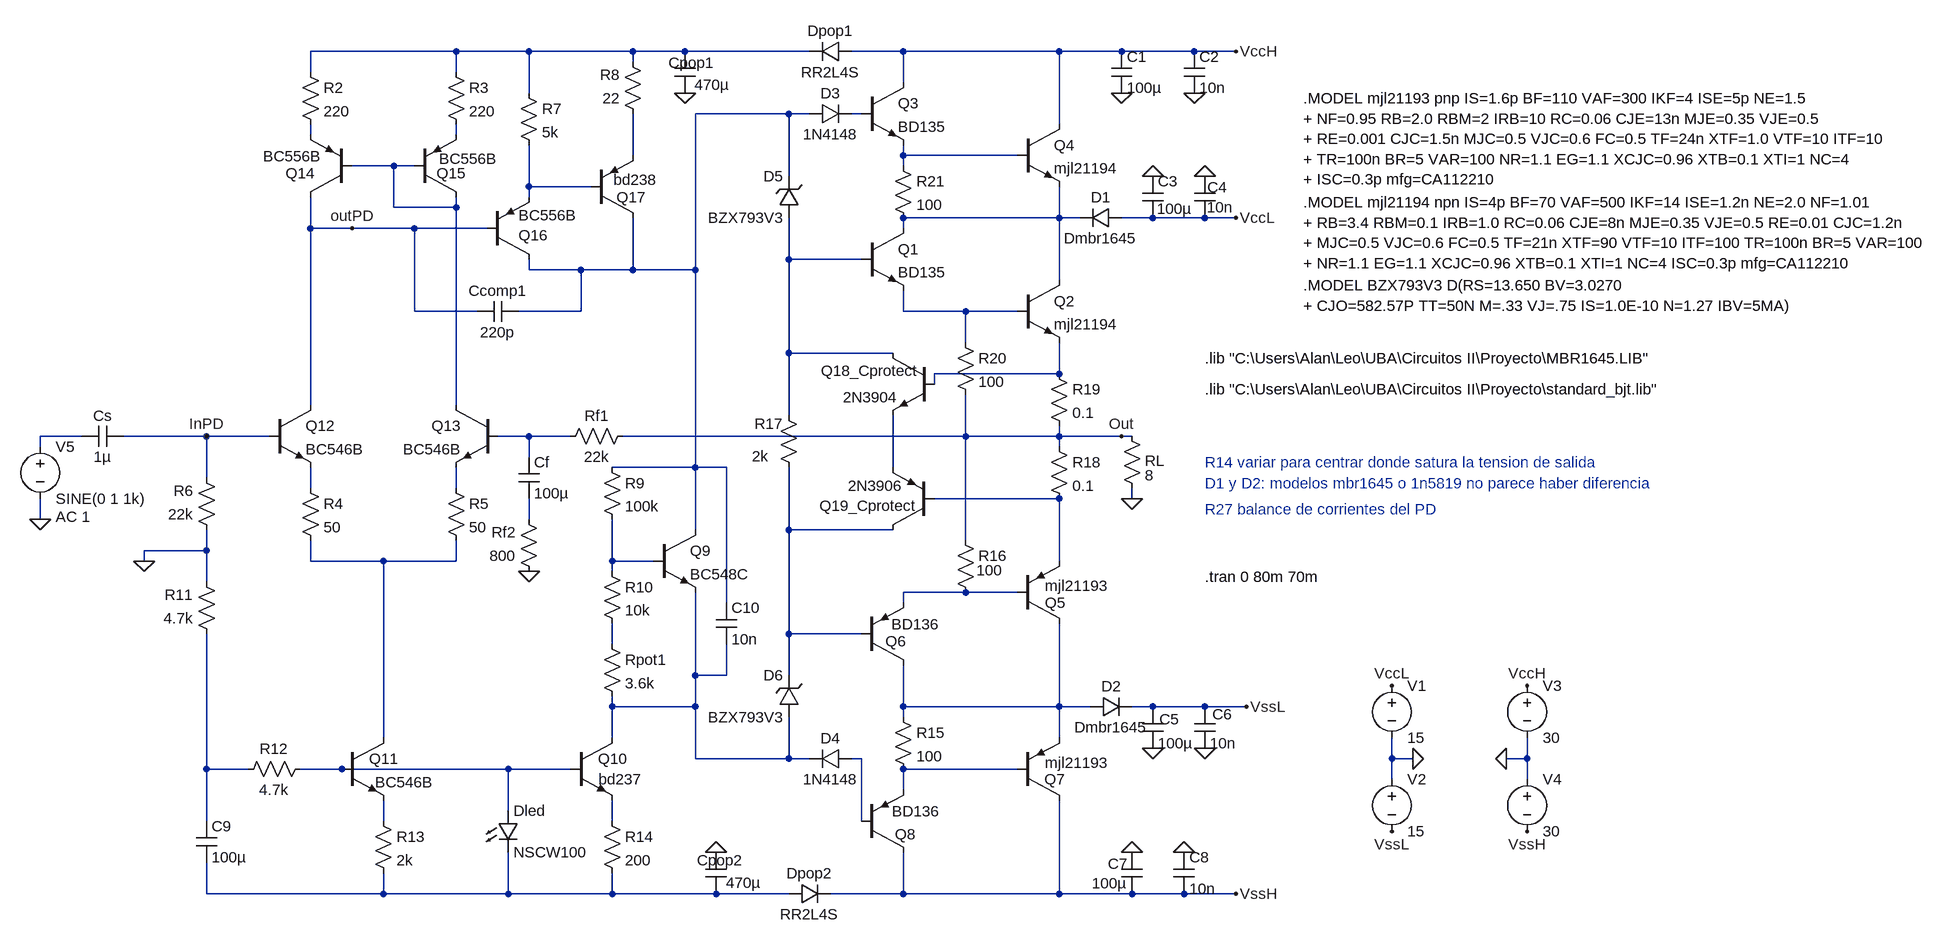
[diagram p0: schematic etapa_ampli_2Darli.asc]
etapa_ampli_2Darli.asc, the LTspice schematic file:
Version 4
SHEET 1 2408 1408
WIRE -512 48 -736 48
WIRE -400 48 -512 48
WIRE -240 48 -400 48
WIRE -160 48 -240 48
WIRE 32 48 -160 48
WIRE 176 48 96 48
WIRE 416 48 176 48
WIRE 512 48 416 48
WIRE 624 48 512 48
WIRE 688 48 624 48
WIRE -240 64 -240 48
WIRE -736 80 -736 48
WIRE -512 80 -512 48
WIRE 176 96 176 48
WIRE -400 112 -400 48
WIRE 0 144 -144 144
WIRE 32 144 0 144
WIRE 112 144 96 144
WIRE 416 160 416 48
WIRE -736 176 -736 160
WIRE -512 176 -512 160
WIRE -240 208 -240 144
WIRE 176 208 176 192
WIRE 352 208 176 208
WIRE -608 224 -672 224
WIRE -576 224 -608 224
WIRE 176 224 176 208
WIRE 0 240 0 144
WIRE -400 256 -400 192
WIRE -304 256 -400 256
WIRE -400 272 -400 256
WIRE -608 288 -608 224
WIRE -512 288 -512 272
WIRE -512 288 -608 288
WIRE 416 304 416 256
WIRE 416 304 176 304
WIRE 448 304 416 304
WIRE 560 304 512 304
WIRE 640 304 560 304
WIRE 688 304 640 304
WIRE -736 320 -736 272
WIRE -672 320 -736 320
WIRE -576 320 -672 320
WIRE -464 320 -576 320
WIRE 176 320 176 304
WIRE 0 368 0 304
WIRE 112 368 0 368
WIRE -400 384 -400 368
WIRE -320 384 -400 384
WIRE -240 384 -240 304
WIRE -240 384 -320 384
WIRE -144 384 -144 144
WIRE -144 384 -240 384
WIRE 416 400 416 304
WIRE -576 448 -576 320
WIRE -480 448 -576 448
WIRE -320 448 -320 384
WIRE -320 448 -416 448
WIRE 176 448 176 416
WIRE 272 448 176 448
WIRE 352 448 272 448
WIRE 272 496 272 448
WIRE 0 512 0 368
WIRE 160 512 0 512
WIRE 416 544 416 496
WIRE 416 544 224 544
WIRE 224 560 224 544
WIRE -736 592 -736 320
WIRE -512 592 -512 288
WIRE 0 608 0 512
WIRE -1088 640 -1152 640
WIRE -896 640 -1024 640
WIRE -800 640 -896 640
WIRE -400 640 -448 640
WIRE -336 640 -400 640
WIRE 272 640 272 576
WIRE 272 640 -256 640
WIRE 416 640 416 624
WIRE 416 640 272 640
WIRE 512 640 416 640
WIRE 528 640 512 640
WIRE -1152 656 -1152 640
WIRE 416 656 416 640
WIRE -400 672 -400 640
WIRE -144 688 -144 384
WIRE -144 688 -272 688
WIRE -96 688 -144 688
WIRE 160 688 160 608
WIRE -896 704 -896 640
WIRE -736 720 -736 688
WIRE -512 720 -512 688
WIRE 416 736 224 736
WIRE 528 736 528 720
WIRE -1152 768 -1152 736
WIRE -400 768 -400 736
WIRE -144 784 -144 688
WIRE 0 784 0 688
WIRE 160 784 0 784
WIRE 272 800 272 640
WIRE -896 816 -896 784
WIRE -896 816 -992 816
WIRE -992 832 -992 816
WIRE -736 832 -736 800
WIRE -624 832 -736 832
WIRE -512 832 -512 800
WIRE -512 832 -624 832
WIRE -272 832 -272 768
WIRE -208 832 -272 832
WIRE 416 832 416 736
WIRE -272 848 -272 832
WIRE -896 864 -896 816
WIRE 272 880 176 880
WIRE 352 880 272 880
WIRE -96 896 -96 688
WIRE 176 896 176 880
WIRE 0 944 0 784
WIRE 112 944 0 944
WIRE -272 960 -272 928
WIRE -144 1008 -144 880
WIRE -96 1008 -96 960
WIRE -96 1008 -144 1008
WIRE 0 1008 0 944
WIRE -272 1056 -272 1040
WIRE -144 1056 -144 1008
WIRE -144 1056 -272 1056
WIRE 176 1056 176 992
WIRE 416 1056 416 928
WIRE 416 1056 176 1056
WIRE 464 1056 416 1056
WIRE 560 1056 528 1056
WIRE 640 1056 560 1056
WIRE 704 1056 640 1056
WIRE 176 1072 176 1056
WIRE -624 1104 -624 832
WIRE -272 1104 -272 1056
WIRE 416 1104 416 1056
WIRE -144 1136 -144 1056
WIRE 0 1136 0 1072
WIRE 0 1136 -144 1136
WIRE 32 1136 0 1136
WIRE 112 1136 96 1136
WIRE 928 1136 928 1104
WIRE 960 1136 928 1136
WIRE 1136 1136 1136 1104
WIRE 1136 1136 1104 1136
WIRE -896 1152 -896 944
WIRE -832 1152 -896 1152
WIRE -688 1152 -752 1152
WIRE -432 1152 -688 1152
WIRE -336 1152 -432 1152
WIRE 352 1152 176 1152
WIRE 928 1168 928 1136
WIRE 1136 1168 1136 1136
WIRE 176 1184 176 1152
WIRE -432 1216 -432 1152
WIRE -896 1232 -896 1152
WIRE -624 1232 -624 1200
WIRE -272 1232 -272 1200
WIRE 112 1232 112 1136
WIRE -896 1344 -896 1296
WIRE -624 1344 -624 1312
WIRE -624 1344 -896 1344
WIRE -432 1344 -432 1280
WIRE -432 1344 -624 1344
WIRE -272 1344 -272 1312
WIRE -272 1344 -432 1344
WIRE -112 1344 -272 1344
WIRE 0 1344 -112 1344
WIRE 176 1344 176 1280
WIRE 176 1344 64 1344
WIRE 416 1344 416 1200
WIRE 416 1344 176 1344
WIRE 528 1344 416 1344
WIRE 608 1344 528 1344
WIRE 688 1344 608 1344
FLAG 688 304 VccL
FLAG 688 48 VccH
FLAG 528 736 0
FLAG 688 1344 VssH
FLAG 960 1136 0
FLAG 1104 1136 0
FLAG 1136 1024 VccH
FLAG 928 1024 VccL
FLAG 1136 1248 VssH
FLAG 928 1248 VssL
FLAG 512 640 Out
FLAG -400 848 0
FLAG -992 832 0
FLAG 704 1056 VssL
FLAG -896 640 InPD
FLAG -160 112 0
FLAG -112 1280 0
FLAG 560 1120 0
FLAG 528 1280 0
FLAG 560 240 0
FLAG 512 112 0
FLAG 624 112 0
FLAG 608 1280 0
FLAG 640 240 0
FLAG 640 1120 0
FLAG -672 320 outPD
FLAG -1152 768 0
DATAFLAG 48 368 "$-V(N013)"
DATAFLAG 48 944 "$-V(N019)"
DATAFLAG 416 112 "$-V(N010)"
DATAFLAG 416 1248 "$-V(N027)"
SYMBOL res 512 624 R0
WINDOW 0 36 54 Left 2
SYMATTR InstName RL
SYMATTR Value 8
SYMBOL voltage 928 1008 R0
WINDOW 123 0 0 Left 0
WINDOW 39 0 0 Left 0
SYMATTR InstName V1
SYMATTR Value 15
SYMBOL voltage 928 1152 R0
WINDOW 123 0 0 Left 0
WINDOW 39 0 0 Left 0
SYMATTR InstName V2
SYMATTR Value 15
SYMBOL voltage 1136 1008 R0
WINDOW 123 0 0 Left 0
WINDOW 39 0 0 Left 0
SYMATTR InstName V3
SYMATTR Value 30
SYMBOL voltage 1136 1152 R0
WINDOW 123 0 0 Left 0
WINDOW 39 0 0 Left 0
SYMATTR InstName V4
SYMATTR Value 30
SYMBOL diode 32 160 R270
WINDOW 0 32 32 VTop 2
WINDOW 3 0 32 VBottom 2
SYMATTR InstName D3
SYMATTR Value 1N4148
SYMBOL diode 96 1120 R90
WINDOW 0 0 32 VBottom 2
WINDOW 3 32 32 VTop 2
SYMATTR InstName D4
SYMATTR Value 1N4148
SYMBOL npn -208 784 R0
SYMATTR InstName Q9
SYMATTR Value BC548C
SYMBOL res -288 672 R0
SYMATTR InstName R9
SYMATTR Value 100k
SYMBOL res -288 832 R0
SYMATTR InstName R10
SYMATTR Value 10k
SYMBOL npn -336 1104 R0
WINDOW 0 42 32 Left 2
WINDOW 3 43 64 Left 2
SYMATTR InstName Q10
SYMATTR Value bd237
SYMBOL res -288 1216 R0
SYMATTR InstName R14
SYMATTR Value 200
SYMBOL npn -448 592 M0
SYMATTR InstName Q13
SYMATTR Value BC546B
SYMBOL res -240 624 R90
WINDOW 0 0 56 VBottom 2
WINDOW 3 32 56 VTop 2
SYMATTR InstName Rf1
SYMATTR Value 22k
SYMBOL res -384 864 R180
WINDOW 0 36 76 Left 2
WINDOW 3 36 40 Left 2
SYMATTR InstName Rf2
SYMATTR Value 800
SYMBOL cap -416 672 R0
SYMATTR InstName Cf
SYMATTR Value 100µ
SYMBOL res -16 592 R0
WINDOW 0 -37 29 Left 2
WINDOW 3 -41 79 Left 2
SYMATTR InstName R17
SYMATTR Value 2k
SYMBOL npn -800 592 R0
SYMATTR InstName Q12
SYMATTR Value BC546B
SYMBOL npn -688 1104 R0
WINDOW 0 42 32 Left 2
WINDOW 3 51 68 Left 2
SYMATTR InstName Q11
SYMATTR Value BC546B
SYMBOL res -640 1216 R0
SYMATTR InstName R13
SYMATTR Value 2k
SYMBOL res -736 1136 R90
WINDOW 0 0 56 VBottom 2
WINDOW 3 32 56 VTop 2
SYMATTR InstName R12
SYMATTR Value 4.7k
SYMBOL res -880 800 R180
WINDOW 0 36 76 Left 2
WINDOW 3 36 40 Left 2
SYMATTR InstName R6
SYMATTR Value 22k
SYMBOL res -880 960 R180
WINDOW 0 36 76 Left 2
WINDOW 3 36 40 Left 2
SYMATTR InstName R11
SYMATTR Value 4.7k
SYMBOL cap -912 1232 R0
SYMATTR InstName C9
SYMATTR Value 100µ
SYMBOL cap -1024 624 R90
WINDOW 0 0 32 VBottom 2
WINDOW 3 32 32 VTop 2
SYMATTR InstName Cs
SYMATTR Value 1µ
SYMBOL pnp -672 272 R180
WINDOW 0 57 37 Left 2
WINDOW 3 48 63 Left 2
SYMATTR InstName Q14
SYMATTR Value BC556B
SYMBOL pnp -576 272 M180
WINDOW 0 34 37 Left 2
WINDOW 3 38 59 Left 2
SYMATTR InstName Q15
SYMATTR Value BC556B
SYMBOL res -416 96 R0
SYMATTR InstName R7
SYMATTR Value 5k
SYMBOL pnp -464 368 M180
WINDOW 0 48 37 Left 2
WINDOW 3 48 68 Left 2
SYMATTR InstName Q16
SYMATTR Value BC556B
SYMBOL zener 16 1072 R180
WINDOW 0 24 64 Left 2
WINDOW 3 24 0 Left 2
SYMATTR InstName D6
SYMATTR Value BZX793V3
SYMBOL zener 16 304 R180
WINDOW 0 24 64 Left 2
WINDOW 3 24 0 Left 2
SYMATTR InstName D5
SYMATTR Value BZX793V3
SYMBOL LED -448 1216 R0
SYMATTR InstName Dled
SYMATTR Value NSCW100
SYMBOL res -224 160 R180
WINDOW 0 36 76 Left 2
WINDOW 3 36 40 Left 2
SYMATTR InstName R8
SYMATTR Value 22
SYMBOL pnp -304 304 M180
WINDOW 0 39 32 Left 2
WINDOW 3 34 59 Left 2
SYMATTR InstName Q17
SYMATTR Value bd238
SYMBOL cap -416 432 R90
WINDOW 0 0 32 VBottom 2
WINDOW 3 32 32 VTop 2
SYMATTR InstName Ccomp1
SYMATTR Value 220p
SYMBOL diode 0 1360 R270
WINDOW 0 32 32 VTop 2
WINDOW 3 0 32 VBottom 2
SYMATTR InstName Dpop2
SYMATTR Value RR2L4S
SYMBOL diode 96 32 R90
WINDOW 0 0 32 VBottom 2
WINDOW 3 32 32 VTop 2
SYMATTR InstName Dpop1
SYMATTR Value RR2L4S
SYMBOL cap -144 112 R180
WINDOW 0 -30 47 Left 2
WINDOW 3 -53 13 Left 2
SYMATTR InstName Cpop1
SYMATTR Value 470µ
SYMBOL cap -96 1344 R180
WINDOW 0 -26 52 Left 2
WINDOW 3 -53 17 Left 2
SYMATTR InstName Cpop2
SYMATTR Value 470µ
SYMBOL cap 512 1280 R0
WINDOW 0 -21 18 Left 2
WINDOW 3 -46 48 Left 2
SYMATTR InstName C7
SYMATTR Value 100µ
SYMBOL cap 496 48 R0
SYMATTR InstName C1
SYMATTR Value 100µ
SYMBOL cap 544 240 R0
WINDOW 3 22 50 Left 2
SYMATTR Value 100µ
SYMATTR InstName C3
SYMBOL cap 544 1056 R0
WINDOW 0 26 19 Left 2
SYMATTR InstName C5
SYMATTR Value 100µ
SYMBOL res -752 64 R0
SYMATTR InstName R2
SYMATTR Value 220
SYMBOL res -528 64 R0
SYMATTR InstName R3
SYMATTR Value 220
SYMBOL cap 608 48 R0
SYMATTR InstName C2
SYMATTR Value 10n
SYMBOL cap 592 1280 R0
SYMATTR InstName C8
SYMATTR Value 10n
SYMBOL cap 624 240 R0
WINDOW 0 20 17 Left 2
WINDOW 3 19 48 Left 2
SYMATTR InstName C4
SYMATTR Value 10n
SYMBOL cap 624 1056 R0
WINDOW 0 28 12 Left 2
SYMATTR InstName C6
SYMATTR Value 10n
SYMBOL diode 464 1072 R270
WINDOW 0 32 32 VTop 2
WINDOW 3 0 32 VBottom 2
SYMATTR InstName D2
SYMATTR Value Dmbr1645
SYMBOL diode 512 288 R90
WINDOW 0 0 32 VBottom 2
WINDOW 3 32 32 VTop 2
SYMATTR InstName D1
SYMATTR Value Dmbr1645
SYMBOL npn 224 512 M0
WINDOW 0 24 27 Left 2
SYMATTR InstName Q18_Cprotect
SYMATTR Value 2N3904
SYMBOL pnp 224 784 R180
WINDOW 0 26 37 Left 2
WINDOW 3 48 68 Left 2
SYMATTR InstName Q19_Cprotect
SYMATTR Value 2N3906
SYMBOL res -752 704 R0
SYMATTR InstName R4
SYMATTR Value 50
SYMBOL res -528 704 R0
SYMATTR InstName R5
SYMATTR Value 50
SYMBOL voltage -1152 640 R0
WINDOW 123 24 124 Left 2
WINDOW 39 0 0 Left 0
SYMATTR Value2 AC 1
SYMATTR InstName V5
SYMATTR Value SINE(0 1 1k)
SYMBOL res 400 640 R0
SYMATTR InstName R18
SYMATTR Value 0.1
SYMBOL res 400 528 R0
SYMATTR InstName R19
SYMATTR Value 0.1
SYMBOL npn 112 320 R0
SYMATTR InstName Q1
SYMATTR Value BD135
SYMBOL npn 352 400 R0
SYMATTR InstName Q2
SYMATTR Value mjl21194
SYMBOL npn 112 96 R0
SYMATTR InstName Q3
SYMATTR Value BD135
SYMBOL npn 352 160 R0
SYMATTR InstName Q4
SYMATTR Value mjl21194
SYMBOL pnp 352 928 M180
WINDOW 0 42 32 Left 2
WINDOW 3 42 58 Left 2
SYMATTR InstName Q5
SYMATTR Value mjl21193
SYMBOL pnp 112 992 M180
WINDOW 0 37 37 Left 2
WINDOW 3 46 63 Left 2
SYMATTR InstName Q6
SYMATTR Value BD136
SYMBOL pnp 352 1200 M180
WINDOW 0 41 32 Left 2
WINDOW 3 42 58 Left 2
SYMATTR InstName Q7
SYMATTR Value mjl21193
SYMBOL pnp 112 1280 M180
WINDOW 0 51 28 Left 2
WINDOW 3 47 63 Left 2
SYMATTR InstName Q8
SYMATTR Value BD136
SYMBOL res 160 1056 R0
SYMATTR InstName R15
SYMATTR Value 100
SYMBOL res 256 784 R0
WINDOW 3 73 62 Right 2
SYMATTR Value 100
SYMATTR InstName R16
SYMBOL res 256 480 R0
SYMATTR InstName R20
SYMATTR Value 100
SYMBOL res 160 208 R0
SYMATTR InstName R21
SYMATTR Value 100
SYMBOL res -288 944 R0
SYMATTR InstName Rpot1
SYMATTR Value 3.6k
SYMBOL cap -112 896 R0
SYMATTR InstName C10
SYMATTR Value 10n
TEXT 640 568 Left 2 !.lib "C:\\Users\\Alan\\Leo\\UBA\\Circuitos II\\Proyecto\\standard_bjt.lib"
TEXT 640 856 Left 2 !.tran 0 80m 70m
TEXT 640 520 Left 2 !.lib "C:\\Users\\Alan\\Leo\\UBA\\Circuitos II\\Proyecto\\MBR1645.LIB"
TEXT 640 712 Left 2 ;D1 y D2: modelos mbr1645 o 1n5819 no parece haber diferencia
TEXT 640 752 Left 2 ;R27 balance de corrientes del PD
TEXT 640 680 Left 2 ;R14 variar para centrar donde satura la tension de salida
TEXT 792 408 Left 2 !.MODEL BZX793V3 D(RS=13.650 BV=3.0270  \n+ CJO=582.57P TT=50N M=.33 VJ=.75 IS=1.0E-10 N=1.27 IBV=5MA)
TEXT 792 120 Left 2 !.MODEL mjl21193 pnp IS=1.6p BF=110 VAF=300 IKF=4 ISE=5p NE=1.5\n+ NF=0.95 RB=2.0 RBM=2 IRB=10 RC=0.06 CJE=13n MJE=0.35 VJE=0.5\n+ RE=0.001 CJC=1.5n MJC=0.5 VJC=0.6 FC=0.5 TF=24n XTF=1.0 VTF=10 ITF=10\n+ TR=100n BR=5 VAR=100 NR=1.1 EG=1.1 XCJC=0.96 XTB=0.1 XTI=1 NC=4\n+ ISC=0.3p mfg=CA112210
TEXT 792 280 Left 2 !.MODEL mjl21194 npn IS=4p BF=70 VAF=500 IKF=14 ISE=1.2n NE=2.0 NF=1.01\n+ RB=3.4 RBM=0.1 IRB=1.0 RC=0.06 CJE=8n MJE=0.35 VJE=0.5 RE=0.01 CJC=1.2n\n+ MJC=0.5 VJC=0.6 FC=0.5 TF=21n XTF=90 VTF=10 ITF=100 TR=100n BR=5 VAR=100\n+ NR=1.1 EG=1.1 XCJC=0.96 XTB=0.1 XTI=1 NC=4 ISC=0.3p mfg=CA112210

The netlist it stands for:
* etapa_ampli_2Darli.asc
RL Out 0 8
V1 VccL 0 15
V2 0 VssL 15
V3 VccH 0 30
V4 0 VssH 30
D3 N002 N003 1N4148
D4 N028 N026 1N4148
Q9 N002 N023 N026 0 BC548C
R9 N002 N023 100k
R10 N023 N025 10k
Q10 N026 N030 N033 0 bd237
R14 N033 N034 200
Q13 N008 N015 N018 0 BC546B
Rf1 Out N015 22k
Rf2 0 N020 800
Cf N015 N020 100µ
R17 N011 N021 2k
Q12 outPD InPD N017 0 BC546B
Q11 N022 N030 N032 0 BC546B
R13 N032 N034 2k
R12 N030 N029 4.7k
R6 0 InPD 22k
R11 N029 0 4.7k
C9 N029 N034 100µ
Cs InPD N014 1µ
Q14 outPD N008 N004 0 BC556B
Q15 N008 N008 N005 0 BC556B
R7 N001 N009 5k
Q16 N002 outPD N009 0 BC556B
D6 N026 N021 BZX793V3
D5 N011 N002 BZX793V3
Dled N030 N034 NSCW100
R8 N006 N001 22
Q17 N002 N009 N006 0 bd238
Ccomp1 N002 outPD 220p
Dpop2 N034 VssH RR2L4S
Dpop1 VccH N001 RR2L4S
Cpop1 0 N001 470µ
Cpop2 N034 0 470µ
C7 0 VssH 100µ
C1 VccH 0 100µ
C3 0 VccL 100µ
C5 VssL 0 100µ
R2 N001 N004 220
R3 N001 N005 220
C2 VccH 0 10n
C8 0 VssH 10n
C4 0 VccL 10n
C6 VssL 0 10n
D2 N027 VssL Dmbr1645
D1 VccL N010 Dmbr1645
Q18_Cprotect N011 N013 N016 0 2N3904
Q19_Cprotect N021 N019 N016 0 2N3906
R4 N017 N022 50
R5 N018 N022 50
V5 N014 0 SINE(0 1 1k) AC 1
R18 Out N019 0.1
R19 N013 Out 0.1
Q1 N010 N011 N012 0 BD135
Q2 N010 N012 N013 0 mjl21194
Q3 VccH N003 N007 0 BD135
Q4 VccH N007 N010 0 mjl21194
Q5 N027 N024 N019 0 mjl21193
Q6 N027 N021 N024 0 BD136
Q7 VssH N031 N027 0 mjl21193
Q8 VssH N028 N031 0 BD136
R15 N027 N031 100
R16 Out N024 100
R20 N012 Out 100
R21 N007 N010 100
Rpot1 N025 N026 3.6k
C10 N002 N026 10n
.model D D
.lib standard.dio
.model NPN NPN
.model PNP PNP
.lib standard.bjt
.lib "C:\Users\Alan\Leo\UBA\Circuitos II\Proyecto\standard_bjt.lib"
.tran 0 80m 70m
.lib "C:\Users\Alan\Leo\UBA\Circuitos II\Proyecto\MBR1645.LIB"
* D1 y D2: modelos mbr1645 o 1n5819 no parece haber diferencia
* R27 balance de corrientes del PD
* R14 variar para centrar donde satura la tension de salida
.MODEL BZX793V3 D(RS=13.650 BV=3.0270
+ CJO=582.57P TT=50N M=.33 VJ=.75 IS=1.0E-10 N=1.27 IBV=5MA)
.MODEL mjl21193 pnp IS=1.6p BF=110 VAF=300 IKF=4 ISE=5p NE=1.5
+ NF=0.95 RB=2.0 RBM=2 IRB=10 RC=0.06 CJE=13n MJE=0.35 VJE=0.5
+ RE=0.001 CJC=1.5n MJC=0.5 VJC=0.6 FC=0.5 TF=24n XTF=1.0 VTF=10 ITF=10
+ TR=100n BR=5 VAR=100 NR=1.1 EG=1.1 XCJC=0.96 XTB=0.1 XTI=1 NC=4
+ ISC=0.3p mfg=CA112210
.MODEL mjl21194 npn IS=4p BF=70 VAF=500 IKF=14 ISE=1.2n NE=2.0 NF=1.01
+ RB=3.4 RBM=0.1 IRB=1.0 RC=0.06 CJE=8n MJE=0.35 VJE=0.5 RE=0.01 CJC=1.2n
+ MJC=0.5 VJC=0.6 FC=0.5 TF=21n XTF=90 VTF=10 ITF=100 TR=100n BR=5 VAR=100
+ NR=1.1 EG=1.1 XCJC=0.96 XTB=0.1 XTI=1 NC=4 ISC=0.3p mfg=CA112210
.backanno
.end